# Altium schematic sheet Alimentation.SchDoc
size A3; Author: Santiago Valiante; Organization: ETML-ES; Address1: Avenue Recordon 1; Address2: 1004 Lausanne; Address3: Switzerland; Revision: 1; SheetNumber: 1; SheetTotal: 2; SPICEModelCacheDFWRECVL: <root> / <DocumentId>DFWRECVL</DocumentId> / <CacheFrame Number="0"> / <Model Name="led2" Kind="MDL"> / <Text>*Typ RED,GREEN,YELLOW,AMBER GaAs LED: Vf=2.1V Vr=4V If=40mA trr=3uS / *LED Pinout: 1=A, 2=K / .MODEL LED2 D (IS=93.1P RS=42M N=4.61 BV=4 IBV=10U / + CJO=2.97P VJ=.75 M=.333 TT=4.32U)</Text> / </Model> / </CacheFrame> / </root>; Version: 1
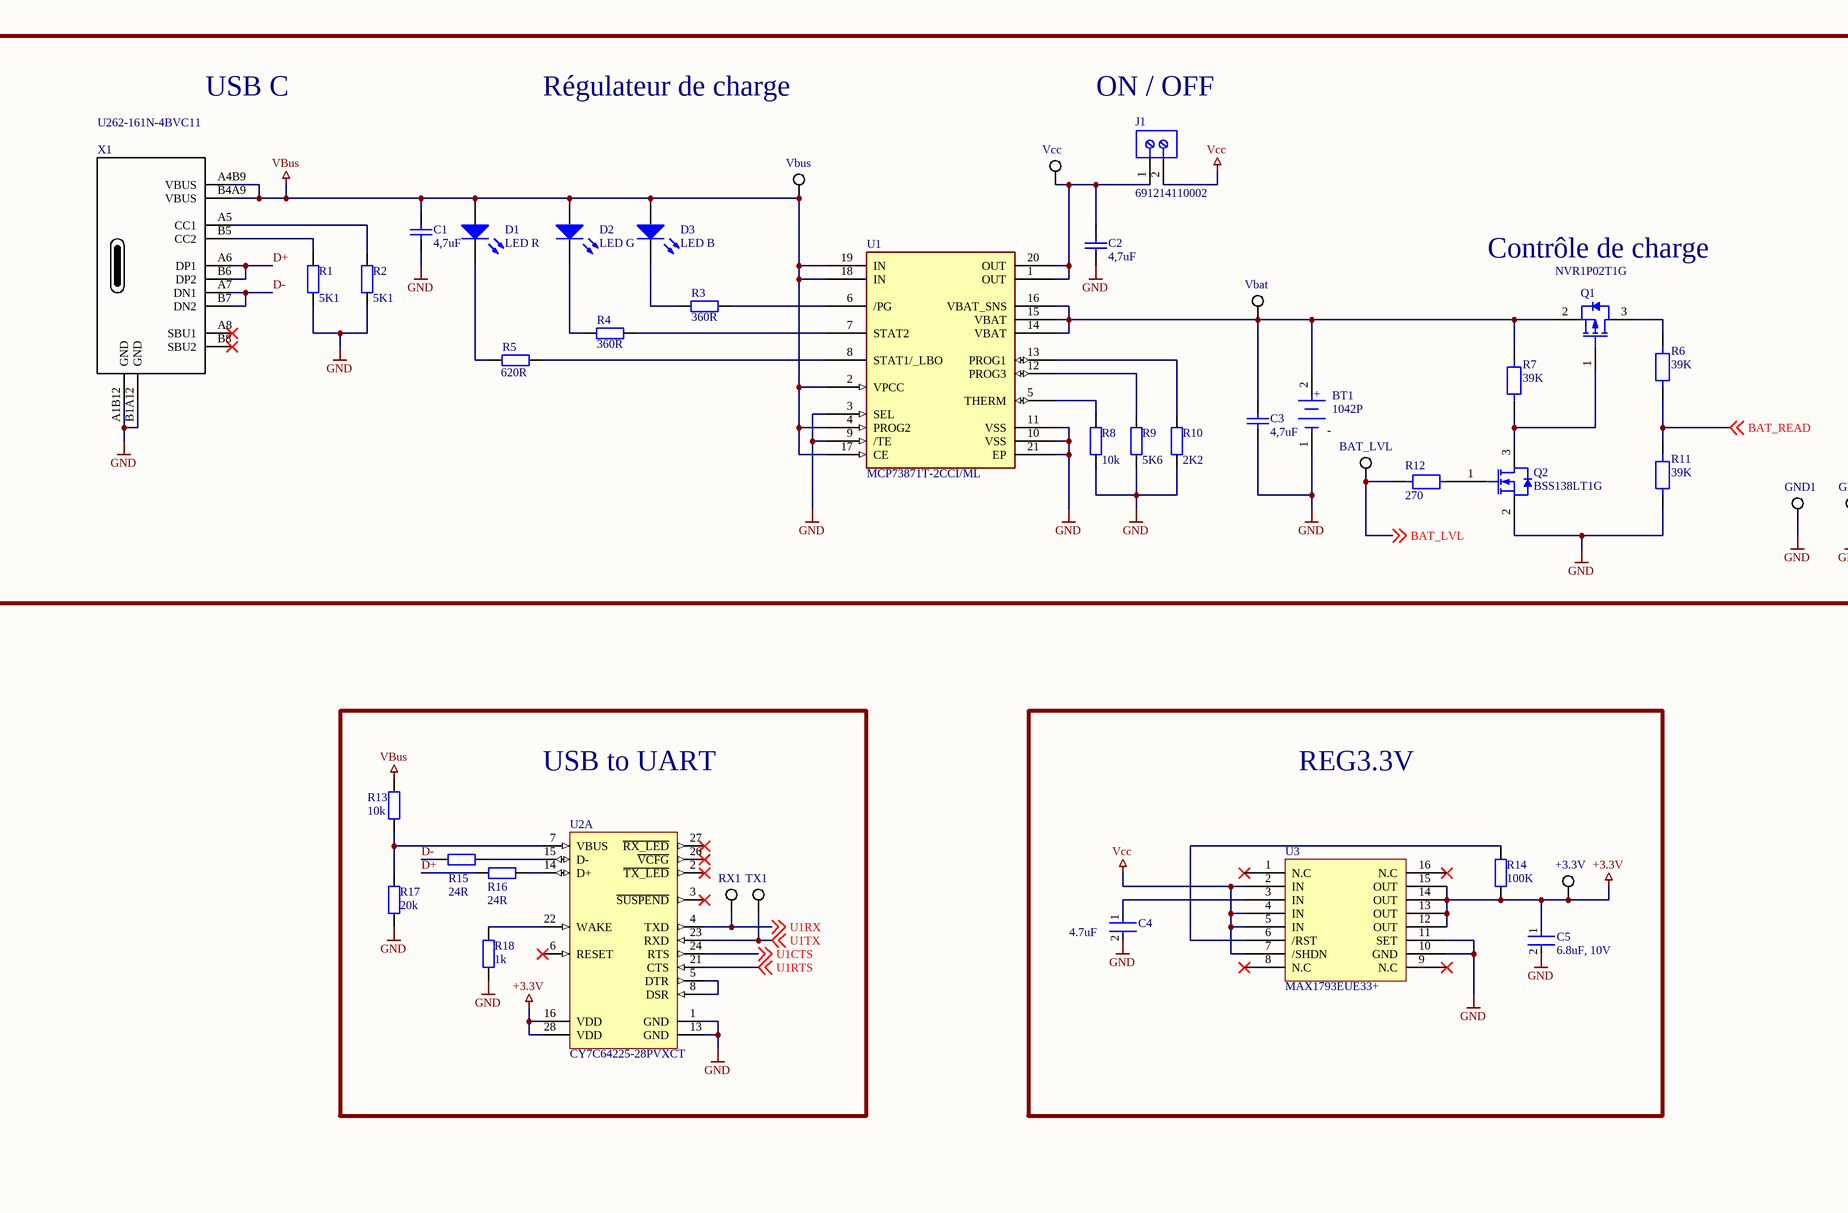
[diagram p0: Alimentation.SchDoc, left]
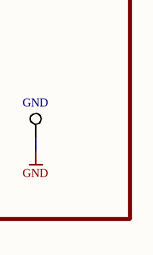
[diagram p1: Alimentation.SchDoc, right]

## Parts
+3.3V  3.3V  [KSTN-5019_V]  (value not drawn)
BAT_LVL  Vbat  [KSTN-5019_V]  (value not drawn)
BT1  1042P  [FP-1042P-MFG]
C1  4,7uF  [CAP_0805]
C2  4,7uF  [CAP_0805]
C3  4,7uF  [CAP_0805]
C4  Capacitance: 4.7uF  [CAP_0805]  (hidden comment: 4.7uF, 35V)
C5  6.8uF, 10V  [CAP_0805]
D1  LED R  [3.2X1.6X1.1]
D2  LED G  [3.2X1.6X1.1]
D3  LED B  [3.2X1.6X1.1]
GND  Vbat  [KSTN-5019_V]  (value not drawn)
GND1  Vbat  [KSTN-5019_V]  (value not drawn)
J1  691214110002  [691214110002]
Q1  NVR1P02T1G  [ONSC-SOT-23-3-318-08_V]
Q2  BSS138LT1G  [ONSC-SOT-23-3-318-08_V]
R1  5K1  [RES_0805]
R2  5K1  [RES_0805]
R3  360R  [RES_0805]
R4  360R  [RES_0805]
R5  620R  [RES_0805]
R6  39K  [RES_0805]
R7  value 39K  [RES_0805]  (hidden comment: 36K)
R8  10K  [RES_0805]
R9  5K6  [RES_0805]
R10  2K2  [RES_0805]
R11  39K  [RES_0805]
R12  value 270  [RES_0805]  (hidden comment: 270R)
R13  10K  [RES_0805]
R14  100K  [RES_0805]
R15  24R  [RES_0805]
R16  24R  [RES_0805]
R17  20K  [RES_0805]
R18  1K  [RES_0805]
RX1  Vbat  [KSTN-5019_V]  (value not drawn)
TX1  Vbat  [KSTN-5019_V]  (value not drawn)
U1  MCP73871T-2CCI/ML  [Microchip_C04V2]
U2  CY7C64225-28PVXCT  [CYP-PVX28_M]  (part A of 2)
U3  MAX1793EUE33+  [TSOP65P640X110_HS-17N]
Vbat  Vbat  [KSTN-5019_V]  (value not drawn)
Vbus  Vbat  [KSTN-5019_V]  (value not drawn)
Vcc  Vbat  [KSTN-5019_V]  (value not drawn)
X1  U262-161N-4BVC11  [GCT_USB4105-GF-A]

## Blocks framed on the sheet
USB to UART: R13 R15-R18 RX1 TX1 U2
REG3.3V: +3.3V C4 C5 R14 U3

## Nets
+3.3V: +3.3V.1 C5.1 R14.1 U2.16(VDD) U2.28(VDD) U3.12(OUT) U3.13(OUT) U3.14(OUT) U3.15(OUT)
GND: BT1.1(C) C1.1 C2.1 C3.1 C4.2 C5.2 GND.1 GND1.1 Q2.2(S) R1.1 R2.1 R8.1 R9.1 R10.1 R11.1 R17.1 R18.1 U1.3(SEL) U1.9(/TE) U1.10(VSS) U1.11(VSS) U1.21(EP) U2.1(GND) U2.13(GND) U3.10(GND) U3.11(SET) X1.A1B12(GND) X1.B1A12(GND)
VBus: C1.2 D1.1(A) D2.1(A) D3.1(A) R13.2 U1.2(VPCC) U1.4(PROG2) U1.17(CE) U1.18(IN) U1.19(IN) Vbus.1 X1.A4B9(VBUS) X1.B4A9(VBUS)
Vcc: J1.2 U3.2(IN) U3.4(IN) U3.5(IN) U3.7(/SHDN)
BAT_LVL: BAT_LVL.1 R12.1 ; off-sheet BAT_LVL
BAT_READ: R6.1 R11.2 ; off-sheet BAT_READ
D+: R16.1 X1.A6(DP1) X1.B6(DP2)
D-: R15.1 X1.A7(DN1) X1.B7(DN2)
U1CTS: U2.24(RTS) ; off-sheet U1CTS
U1RTS: U2.21(CTS) ; off-sheet U1RTS
U1RX: RX1.1 U2.4(TXD) ; off-sheet U1RX
U1TX: TX1.1 U2.23(RXD) ; off-sheet U1TX
NetBT1_2: BT1.2(A) C3.2 Q1.2(S) R7.2 U1.14(VBAT) U1.15(VBAT) U1.16(VBAT_SNS) Vbat.1
NetC2_2: C2.2 J1.1 U1.1(OUT) U1.20(OUT) Vcc.1
NetC4_1: C4.1 U3.3(IN)
NetD1_2: D1.2(K) R5.1
NetD2_2: D2.2(K) R4.2
NetD3_2: D3.2(K) R3.1
NetQ1_1: Q1.1(G) Q2.3(D) R7.1
NetQ1_3: Q1.3(D) R6.2
NetQ2_1: Q2.1(G) R12.2
NetR1_2: R1.2 X1.B5(CC2)
NetR2_2: R2.2 X1.A5(CC1)
NetR3_2: R3.2 U1.6(/PG)
NetR4_1: R4.1 U1.7(STAT2)
NetR5_2: R5.2 U1.8(STAT1/_LBO)
NetR8_2: R8.2 U1.5(THERM)
NetR9_2: R9.2 U1.12(PROG3)
NetR10_2: R10.2 U1.13(PROG1)
NetR13_1: R13.1 R17.2 U2.7(VBUS)
NetR14_2: R14.2 U3.6(/RST)
NetR15_2: R15.2 U2.15(D-)
NetR16_2: R16.2 U2.14(D+)
NetR18_2: R18.2 U2.22(WAKE)
NetU2_5: U2.5(DTR) U2.8(DSR)

Not connected (* = marked no-connect by the designer): U2 2(~{TX_LED})* 3(~{SUSPEND})* 6(RESET)* 26(~{VCFG})* 27(~{RX_LED})*; U3 1(N.C)* 8(N.C)* 9(N.C)* 16(N.C)*; X1 A8(SBU1)* B8(SBU2)*

## Notes on the sheet
- USB C
- Régulateur de charge
- ON / OFF
- Contrôle de charge
- Fichier :
- a
- Date :
- Heure :
- Version :
- Auteur :
- Modif.
- b
- c
- d
- Projet :
- No :
- Nb feuilles
- Feuille n°
- Chemin :
- (in symbol CMP-19636-000019-1) +; -

## Library data of the parts
+3.3V BAT_LVL GND GND1 RX1 TX1 Vbat Vbus Vcc = CMP-1672-00008-1: Test Point, 1 Position SMD, RoHS, Tape and Reel; ComponentLink1Description: Manufacturer URL; Package Quantity: 1000; DatasheetVersion: 03/2014; Packaging: Tape and Reel; ComponentLink2URL: http://www.keyelco.com/product-pdf.cfm?p=1357; ComponentLink1URL: http://www.keyelco.com/; Mount: Surface Mount; Contact Plating: Silver; PackageDescription: 1-Pin Surface Mount Device, Body 3.81 x 2.03 mm; Pins: 1; RoHSCompliant: True; Mounting Technology: Surface Mount; ComponentLink2Description: Datasheet; PackageReference: 5019
BT1 = CMP-19636-000019-1: BATTERY HOLDER 18650 SMD TAB; Number of Cells: 1; Max Operating Temperature: 145°C; Termination: SMD/SMT; Mount: Surface Mount; Min Operating Temperature: -50°C; Package Quantity: 200; Packaging: Tray; Lead Free: Lead Free
C1-C3 = Cap: Capacitor; Published: 8-Jun-2000; LatestRevisionDate: 17-Jul-2002; LatestRevisionNote: Re-released for DXP Platform.; PackageReference: RAD-0.3; Publisher: Altium Limited; PackageDescription: Radial Cap, Thru-Hole; 2 Leads; 0.3 in Pin Spacing
C4 = CMP-08246-002735-1: Multilayer Ceramic Capacitors 4.7μF ±10% 35V X7R SMD 0805; Tolerance: 10%; Depth: 1.25mm; RoHS Compliant: Yes; Construction: Flat; Radiation Hardening: No; Lead Free: Lead Free; Weight: 0.000194oz; Termination: SMD/SMT; Package Quantity: 2000; Dielectric: X7R; Mount: Surface Mount; Voltage Rating: 35V; Case/Package: 0805; Min Operating Temperature: -55°C; Dielectric Material: Ceramic; REACH SVHC: No SVHC; Series: C; Thickness: 0.057inch; Packaging: Tape and Reel; Case Code (Metric): 2012; Max Operating Temperature: 125°C; Case Code (Imperial): 0805; Height: 1.25mm; Width: 0.049inch; Length: 2mm; Voltage Rating (DC): 35V
C5 = CMP-08246-000118-1: Cap Ceramic 6.8uF 10V X5R 20% Pad SMD 0805 +85°C Automotive T/R; Capacitance: 6.8uF; Packaging: Tape and Reel; Package Quantity: 2000; Width: 0.049inch; Voltage Rating (DC): 10V; Case Code (Imperial): 0805; Ratings: AEC-Q200; Min Operating Temperature: -55°C; Tolerance: 20%; Length: 0.079inch; Case/Package: 0805; Thickness: 0.057inch; Weight: 0.000194oz; Voltage Rating: 10V; Dielectric: X5R; Case Code (Metric): 2012; Height: 1.25mm; Max Operating Temperature: 85°C; Mount: Surface Mount
D1-D3 = LED2: Typical RED, GREEN, YELLOW, AMBER GaAs LED; Published: 8-Jun-2000; LatestRevisionDate: 17-Jul-2002; LatestRevisionNote: Re-released for DXP Platform.; PackageVersion: Feb-2002; PackageReference: 3.2X1.6X1.1; Publisher: Altium Limited; PackageDescription: SM LED; 2 Flat Leads
J1 = CMP-1502-02464-1: Serie 2141 - 3.50 mm Horizontal Entry Modular with Rising Cage Clamp WR-TBL, 2 pin; Manufacturer: Wurth Elektronik; Pin Number: 2; Pitch: 3.50mm; Datasheet URL: http://katalog.we-online.de/em/datasheet/6912141100xx.pdf; Packaging: Box; Mounting Technology: THT; Package Reference: 691214110002; Manufacturer URL: http://www.we-online.de; Part Number: 691214110002; Publisher: WurthElektronik; Operating Temperature: -40to105degC
Q1 = CMP-1058-00745-1: Power MOSFET, -20 V, -1 A, P-Channel, 3-Pin SOT-23, Pb-Free, Tape and Reel; Manufacturer: On Semiconductor; Ciss Typ (pF): 165; Configuration: Single; VGS(th) Max (V): 2.3; Channel Polarity: P Channel; V(BR)DSS Min (V): 20; ID Max (A): 1; Coss Typ (pF): 110; Qrr Typ (nC): 8; Crss Typ (pF): 35; PD Max (W): 0.4; DatasheetVersion: Rev. 7; ComponentLink1Description: Manufacturer URL; PackageReference: SOT-23-3-318-08; ComponentLink2Description: Datasheet; ComponentLink2URL: http://www.onsemi.cn/pub_link/Collateral/NTR1P02T1-D.PDF; Packing: Tape and Reel; Package Type: SOT-23-3; ComponentLink1URL: http://www.onsemi.com/; RoHS: Pb-Free; PartNumber: NVR1P02T1G; PackageVersion: Rev. AP, 11/2009; PackageDescription: 3-Pin Small Outline Transistor, Body 2.92 x 1.3 mm, Pitch 0.95 mm; ComponentLink3URL: http://www.onsemi.cn/pub_link/Collateral/318-08.PDF; ComponentLink3Description: Package Specification; VGS Max (V): 20; Mounting Technology: Surface Mount
Q2 = CMP-1058-00767-1: Power MOSFET, 200 mA, 50 V, N-Channel, 3-Pin SOT-23, Pb-Free, Tape and Reel; Manufacturer: On Semiconductor; PD Max (W): 0.225; Coss Typ (pF): 12; V(BR)DSS Min (V): 50; VGS Max (V): 20; Channel Polarity: N Channel; Configuration: Single; VGS(th) Max (V): 1.5; Ciss Typ (pF): 40; Crss Typ (pF): 3.5; ID Max (A): 0.2; ComponentLink3Description: Package Specification; PackageDescription: 3-Pin Small Outline Transistor, Body 2.92 x 1.3 mm, Pitch 0.95 mm; PackageReference: SOT-23-3-318-08; RoHS: Pb-Free; Mounting Technology: Surface Mount; ComponentLink1Description: Manufacturer URL; ComponentLink2URL: http://www.onsemi.com/pub_link/Collateral/BSS138LT1-D.PDF; ComponentLink2Description: Datasheet; Packing: Tape and Reel; PackageVersion: Rev. AP, 11/2009; PartNumber: BSS138LT1G; Package Type: SOT-23-3; ComponentLink1URL: http://www.onsemi.com/; DatasheetVersion: Rev. 8; ComponentLink3URL: http://www.onsemi.cn/pub_link/Collateral/318-08.PDF
R1-R5 R8-R10 R13 R15-R18 = Res2: Resistor; Published: 8-Jun-2000; LatestRevisionDate: 17-Jul-2002; LatestRevisionNote: Re-released for DXP Platform.; PackageReference: AXIAL-0.4; Publisher: Altium Limited; PackageDescription: Axial Device, Thru-Hole; 2 Leads; 0.4 in Pin Spacing
  R1 R2: Value: 5K1
  R3 R4: Value: 360R
  R8 R13: Value: 10k
  R9: Value: 5K6
  R10: Value: 2K2
  R15 R16: Value: 24R
  R17: Value: 20k
  R18: Value: 1k
R6 R7 R11 R12 = Res3: Resistor; Published: 8-Jun-2000; LatestRevisionDate: 29-May-2009; LatestRevisionNote: IPC-7351 Footprint Added.; PackageReference: J1-0603; Publisher: Altium Limited; PackageDescription: Chip Resistor
  R6 R11: Value: 39K
R14 = CMP-2001-00479-1: Manufacturer: Panasonic; Part Number: ERJ-P06J104V
U1 = MCP73871T-2CCI/ML: Charger IC Lithium Ion/Polymer 20-QFN _4x4_; MF: Microchip; SnapEDA_Link: https://www.snapeda.com/parts/MCP73871T-2CCI/ML/Microchip/view-part/1049920/?ref=snap; Value: *; Digi-Key_Part_Number: MCP73871T-2CCI/MLCT-ND; MP: MCP73871T-2CCI/ML; Digi-Key_Purchase_URL: https://www.digikey.com/product-detail/en/microchip-technology/MCP73871T-2CCI-ML/MCP73871T-2CCI-MLCT-ND/7065594?utm_source=snapeda&utm_medium=aggregator&utm_campaign=symbol; Package: QFN-20 Microchip
U2 = CMP-0967-00141-1: USB-to-UART Bridge Controller, 3 to 5.25 V, 0 to 70 degC, 28-Pin SSOP (PVX28), Tape and Reel; Manufacturer: Cypress; Min. Operating Voltage (V): 3; Memory Architecture: Flash; Max. Operating Voltage (V): 5.25; ComponentLink3URL: http://www.cypress.com/?docID=1371; ComponentLink1URL: http://www.cypress.com/; PackageVersion: Rev. *C, 10/2001; DatasheetVersion: Rev. *D; PackageDescription: 28-Pin Super Small Outline Package, Body 10.2 x 5.3 mm, Pitch 0.65 mm; Min. Operating Temp. (degreesC): 0; RoHS: Pb-Free; ComponentLink2URL: http://www.cypress.com/?docID=48153; Max. Operating Temp. (degreesC): 70; ComponentLink3Description: Package Specification; PartNumber: CY7C64225-28PVXCT; PackageReference: PVX28; Mounting Technology: Surface Mount; ComponentLink1Description: Manufacturer URL; Packing: Tape and Reel; ComponentLink2Description: Datasheet
X1 = USB-C Type 2.0: U262-161N-4BVC11 / XKB Connectivity; ComponentLink1Description: LCSC  C319148; ComponentLink1URL: https://lcsc.com/product-detail/USB-Connectors_XKB-Connectivity-U262-161N-4BVC11_C319148.html; Supplier 1: LCSC; Supplier Part Number 1: C319148